# EAGLE design d11_pogo (EAGLE 7.3.0)
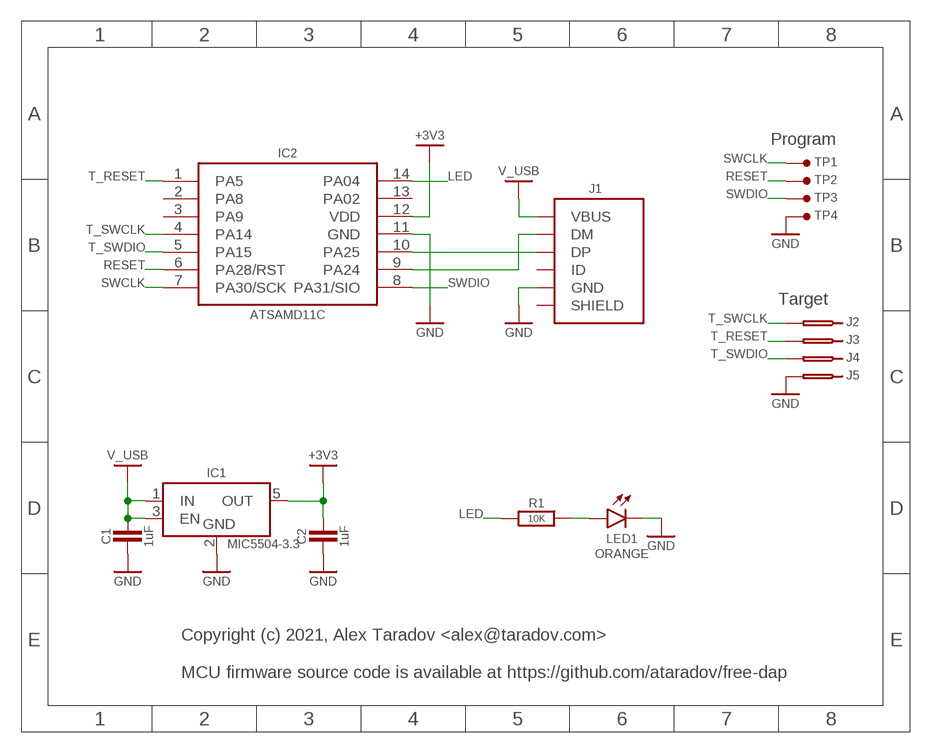
[diagram p0: schematic, sheet 1]

## Parts
C1  1uF  C-0603  [SMD0603]
C2  1uF  C-0603  [SMD0603]
IC1  MIC5504-3.3  MIC5504-SOT23-5  [SOT23-5]
IC2  ATSAMD11C  [SO-14]
J1  USB-B-MICRO-SMT  [USB-B-MICRO-SMT-SHELL-TH]
J2  POGO-PIN-SMD  [POGO-PIN]
J3  POGO-PIN-SMD  [POGO-PIN]
J4  POGO-PIN-SMD  [POGO-PIN]
J5  POGO-PIN-SMD  [POGO-PIN]
LED1  ORANGE  LED_SMDLED_0603  [SMD0603]
R1  10K  R-0603  [SMD0603]
TP1  TEST-POINT-1.27MM  [TP-1.27MM]
TP2  TEST-POINT-1.27MM  [TP-1.27MM]
TP3  SIO  TEST-POINT-1.27MM  [TP-1.27MM]
TP4  TEST-POINT-1.27MM  [TP-1.27MM]

## Nets
+3V3: C2.2 IC1.5(OUT) IC2.12(VDD)
GND: C1.1 C2.1 IC1.2(GND) IC2.11(GND) J1.5(GND) J5.1 J5.2 LED1.2(C) TP4.1
LED: IC2.14(PA04) R1.1
N$1: IC2.9(PA24) J1.2(DM)
N$2: IC2.10(PA25) J1.3(DP)
N$3: LED1.1(A) R1.2
RESET: IC2.6(PA28/RST) TP2.1
SWCLK: IC2.7(PA30/SCK) TP1.1
SWDIO: IC2.8(PA31/SIO) TP3.1
T_RESET: IC2.1(PA5) J3.1 J3.2
T_SWCLK: IC2.4(PA14) J2.1 J2.2
T_SWDIO: IC2.5(PA15) J4.1 J4.2
V_USB: C1.2 IC1.1(IN) IC1.3(EN) J1.1(VBUS)
Unconnected: IC2.2(PA8) IC2.3(PA9) IC2.13(PA02) J1.4(ID) J1.M1(SHIELD) J1.M2(SHIELD) J1.M3(SHIELD) J1.M4(SHIELD)

## Notes on the sheet
- Program
- Target
- Copyright (c) 2021, Alex Taradov <alex@taradov.com>
  
  MCU firmware source code is available at https://github.com/ataradov/free-dap

## Library data of the parts
C1 C2 = ataradov_rlc:C
IC1 = ataradov_vreg:MIC5504: LM1117 voltage regulator
IC2 = ataradov_mcu:ATSAMD11C
J1 = ataradov_conn:USB-B-MICRO
J2-J5 = ataradov_conn:POGO-PIN
LED1 = ataradov_led:LED_SMD: SMD_LED
R1 = ataradov_rlc:R
TP1-TP4 = ataradov_misc:TEST-POINT: Test Point

## Board
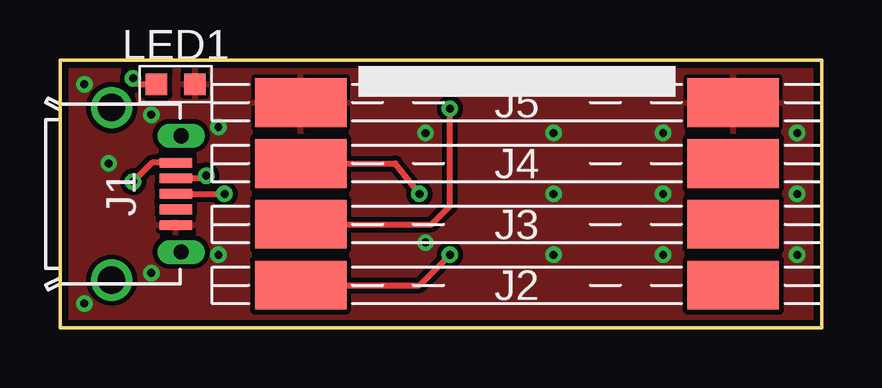
[diagram p1: board, top side]
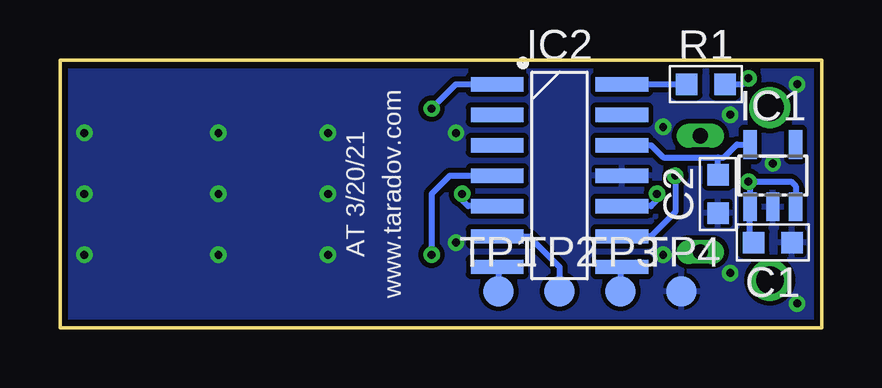
[diagram p2: board, bottom side, seen from below]

Size 31.75 x 11.18 mm. Coordinates in mm from the lower left corner, seen from the top.
Outline: 0,0 31.75,0 31.75,11.18 0,11.18 0,0
Copper layers (1*16): Top 0.0356mm / dielectric 1.5011mm / Bottom 0.0356mm
Design rules "std-tented-new": minimum track width 8mil, minimum drill 12mil, track to track 6mil, track to pad 6mil, pad to pad 6mil, via to via 6mil, smd to smd 0mil, copper to edge 10mil, drill to drill 6mil, minimum pad ring 7mil, minimum via ring 7mil, stop-mask expansion 3mil, vias tented up to drill 25mil, thermal gap 6mil

### Footprints (pad centres in the part's own frame; a part is rotated, then mirrored left to right if it is on the bottom)
SMD0603 = smd 0.9 x 0.9: 1 -0.8,0; 2 0.8,0
SOT23-5 = smd 0.55 x 1.2: 1 -0.95,-1.3; 2 0,-1.3; 3 0.95,-1.3; 4 0.95,1.3; 5 -0.95,1.3
SO-14 = smd 0.6 x 2.2: 1 -3.81,-2.6; 2 -2.54,-2.6; 3 -1.27,-2.6; 4 0,-2.6; 5 1.27,-2.6; 6 2.54,-2.6; 7 3.81,-2.6; 8 3.81,2.6; 9 2.54,2.6; 10 1.27,2.6; 11 0,2.6; 12 -1.27,2.6; 13 -2.54,2.6; 14 -3.81,2.6
USB-B-MICRO-SMT-SHELL-TH = smd 1.35 x 0.4: 1 4.825,1.3; 2 4.825,0.65; 3 4.825,0; 4 4.825,-0.65; 5 4.825,-1.3 | drill 1.143: M1 2.15,-3.6; M2 2.15,3.6 | drill 0.635 long: M3 5.05,2.425; M4 5.05,-2.425
POGO-PIN = smd 3.81 x 2.032: 1 3.683,0; 2 21.717,0
TP-1.27MM = smd 1.27 x 1.27: 1 0,0

### Placement (x,y rotation side)
C1  2.03,3.56 180 bottom
C2  4.32,5.59 90 bottom
IC1  2.03,6.35 0 bottom
IC2  10.92,6.35 270 bottom
J1  0,5.59 0 top
J2  31.75,1.78 180 top
J3  31.75,4.32 180 top
J4  31.75,6.86 180 top
J5  31.75,9.4 180 top
LED1  4.83,10.16 0 top
R1  4.83,10.16 0 bottom
TP1  13.46,1.52 0 bottom
TP2  10.92,1.52 0 bottom
TP3  8.38,1.52 0 bottom
TP4  5.84,1.52 0 bottom

### Tracks (layer width: path | path; a pad name or v marks a point on that pad's centre or on a via)
+3V3
  Bottom 0.254: IC2.12 7.11,7.62 6.6,7.11 4.32,7.11 | 4.32,7.11 4.06,7.11 3.53,7.65 IC1.5 | C2.2 4.32,7.11
GND  (via drill 0.33 pad 0.25)
  other vias: 6.6,8.38 3.81,8.89 20.57,8.13 25.15,8.13 25.15,5.59 30.73,8.13 30.73,5.59 30.73,3.05 25.15,3.05 20.57,3.05 20.57,5.59 1.02,10.16 1.02,1.02 2.03,6.86 3.81,2.29 15.24,3.56 15.24,8.13 6.6,3.05
  pour Bottom (isolate 0.203): 0,11.18 31.75,11.18 31.75,0 0,0
  pour Top (isolate 0.203): 0,11.18 31.75,11.18 31.75,0 0,0
LED
  Bottom 0.254: IC2.14 R1.1
N$1  (via drill 0.33 pad 0.25)
  Top 0.254: v6.1,6.35 5.98,6.24 J1.2
  Bottom 0.254: IC2.9 7.11,3.81 6.1,4.83 v6.1,6.35
N$2  (via drill 0.33 pad 0.25)
  Top 0.254: J1.3 v6.86,5.59
  Bottom 0.254: v6.86,5.59 6.86,5.33 7.11,5.08 IC2.10
N$3  (via drill 0.33)
  Top 0.254: v3.05,10.41 3.3,10.16 LED1.1
  Bottom 0.254: LED1.1 3.3,10.16 v3.05,10.41
RESET
  Bottom 0.254: IC2.6 12.19,3.81 10.92,2.54 TP2.1
SWCLK
  Bottom 0.254: IC2.7 13.46,2.48 TP1.1
SWDIO
  Bottom 0.254: IC2.8 8.38,2.48 TP3.1
T_RESET  (via drill 0.33)
  Top 0.254: J3.2 15.49,4.32 16.26,5.08 v16.26,9.14
  Bottom 0.254: IC2.1 15.24,10.16 v16.26,9.14
T_SWCLK  (via drill 0.33)
  Top 0.254: J2.2 14.99,1.78 v16.26,3.05
  Bottom 0.254: IC2.4 15.49,6.35 16.26,5.59 v16.26,3.05
T_SWDIO  (via drill 0.33)
  Top 0.254: J4.2 13.97,6.86 v14.99,5.59
  Bottom 0.254: IC2.5 14.73,5.08 14.99,5.33 v14.99,5.59
V_USB  (via drill 0.33)
  Top 0.254: J1.1 3.84,6.89 v3.05,6.1
  Bottom 0.254: IC1.3 1.08,5.91 1.27,6.1 v3.05,6.1 2.98,6.03 IC1.1 2.98,3.71 C1.2

### Text on the board
bPlace: www.taradov.com | AT 3/20/21
bValues: GND | SWDIO | RESET | SWCLK